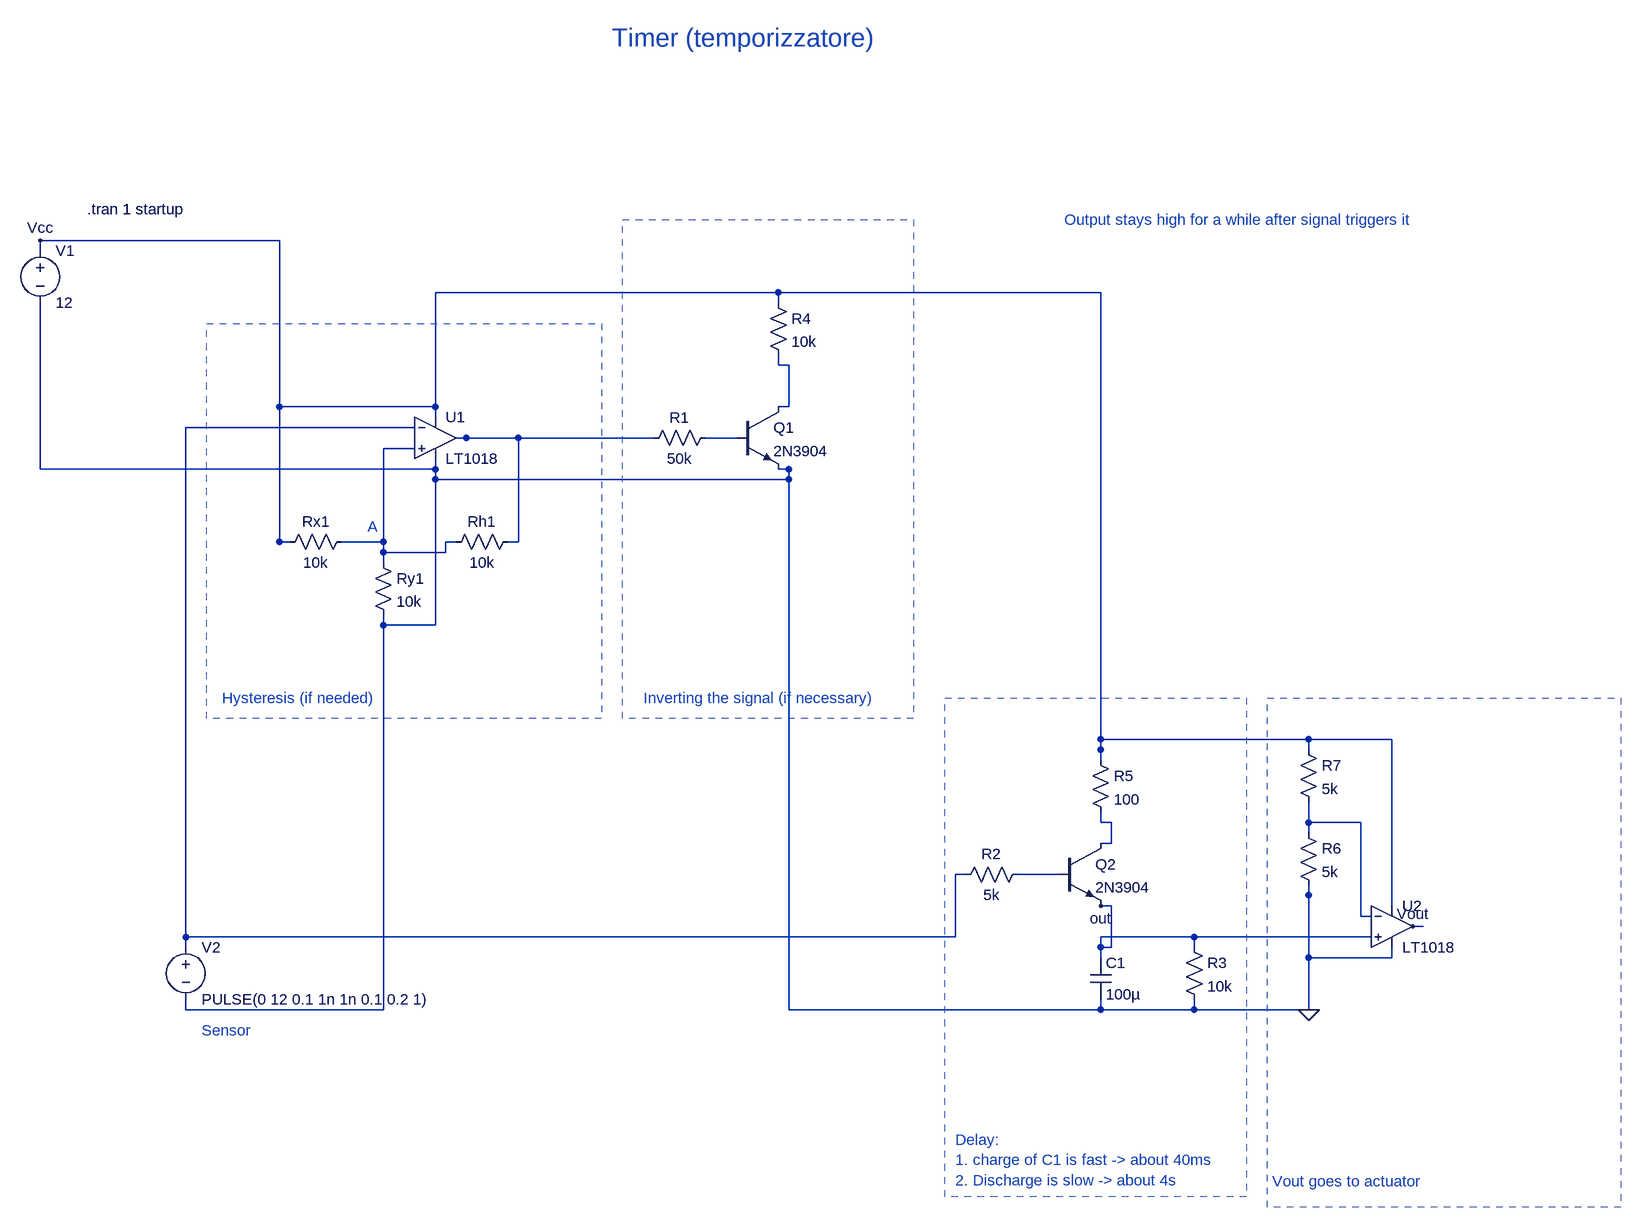
[diagram p0: schematic Sensor-triggered-timer-temporizzatore-2.asc]
Sensor-triggered-timer-temporizzatore-2.asc, the LTspice schematic file:
Version 4.1
SHEET 1 1716 680
WIRE 912 272 912 288
WIRE 416 -544 432 -544
WIRE 1056 272 1056 288
WIRE 1232 96 1232 112
WIRE -192 -320 -192 -304
WIRE -112 -560 -112 -544
WIRE 1360 192 1360 208
WIRE -720 -800 -720 -784
WIRE -496 272 -496 288
WIRE 912 288 1056 288
WIRE 1056 288 1232 288
WIRE 1232 288 1232 112
WIRE 1232 112 1232 208
WIRE 1232 208 1360 208
WIRE 912 288 432 288
WIRE 432 288 432 -544
WIRE 432 -544 432 -528
WIRE 432 -528 -112 -528
WIRE -112 -528 -112 -544
WIRE -112 -544 -112 -304
WIRE -112 -304 -192 -304
WIRE -112 -544 -720 -544
WIRE -720 -544 -720 -784
WIRE -192 -304 -192 288
WIRE -192 288 -496 288
FLAG 1232 288 0
WIRE 416 -640 432 -640
WIRE 416 -720 416 -704
WIRE 432 -640 432 -704
WIRE 432 -704 416 -704
WIRE 704 80 688 80
WIRE -144 -608 -160 -608
WIRE -496 192 -496 176
WIRE 688 80 688 176
WIRE 688 176 -496 176
WIRE -496 176 -496 -608
WIRE -496 -608 -160 -608
WIRE 224 -592 208 -592
WIRE 0 -432 16 -432
WIRE -80 -592 -64 -592
WIRE 208 -592 -64 -592
WIRE -64 -592 16 -592
WIRE 16 -592 16 -432
WIRE 352 -592 336 -592
WIRE 304 -592 320 -592
WIRE 336 -592 320 -592
WIRE -80 -432 -96 -432
WIRE -256 -432 -240 -432
WIRE -192 -400 -192 -416
WIRE -144 -576 -160 -576
WIRE -96 -432 -96 -416
WIRE -96 -416 -192 -416
WIRE -192 -416 -192 -432
WIRE -192 -432 -240 -432
WIRE -192 -416 -192 -576
WIRE -192 -576 -160 -576
WIRE 1232 16 1232 0
WIRE 1232 -32 1232 -16
WIRE 1328 144 1312 144
WIRE 1232 0 1232 -16
WIRE 1232 0 1312 0
WIRE 1312 0 1312 144
WIRE 912 32 928 32
WIRE 912 -16 912 0
WIRE 928 32 928 0
WIRE 928 0 912 0
WIRE 848 80 832 80
WIRE 784 80 800 80
WIRE 832 80 800 80
WIRE 416 -800 416 -816
WIRE 912 -96 912 -112
WIRE 1232 -112 1232 -128
WIRE -336 -432 -352 -432
WIRE -112 -624 -112 -640
WIRE 1360 128 1360 112
WIRE -720 -880 -720 -896
WIRE 416 -816 -112 -816
WIRE -112 -816 -112 -640
WIRE -112 -640 -352 -640
WIRE -352 -640 -352 -432
WIRE -352 -432 -352 -896
WIRE -352 -896 -720 -896
WIRE 416 -816 912 -816
WIRE 912 -816 912 -112
WIRE 912 -112 912 -128
WIRE 912 -128 1232 -128
WIRE 1232 -128 1360 -128
WIRE 1360 -128 1360 112
FLAG -720 -896 Vcc
WIRE 1392 160 1408 160
FLAG 1392 160 Vout
WIRE 912 208 912 192
WIRE 912 128 928 128
WIRE 1056 192 1056 176
WIRE 1328 176 1312 176
WIRE 912 192 928 192
WIRE 928 192 928 128
WIRE 912 192 912 176
WIRE 912 176 1056 176
WIRE 1056 176 1312 176
FLAG 912 128 out
SYMBOL Comparators\\LT1018 -112 -592 R0
SYMATTR InstName U1
SYMBOL voltage -720 -896 R0
WINDOW 123 0 0 Left 0
WINDOW 39 0 0 Left 0
SYMATTR InstName V1
SYMATTR Value 12
SYMBOL res -240 -448 R90
WINDOW 0 0 56 VBottom 2
WINDOW 3 32 56 VTop 2
SYMATTR InstName Rx1
SYMATTR Value 10k
SYMBOL res -208 -416 R0
SYMATTR InstName Ry1
SYMATTR Value 10k
SYMBOL res 16 -448 R90
WINDOW 0 0 56 VBottom 2
WINDOW 3 32 56 VTop 2
SYMATTR InstName Rh1
SYMATTR Value 10k
SYMBOL res 320 -608 R90
WINDOW 0 0 56 VBottom 2
WINDOW 3 32 56 VTop 2
SYMATTR InstName R1
SYMATTR Value 50k
SYMBOL cap 896 208 R0
SYMATTR InstName C1
SYMATTR Value 100µ
SYMBOL res 1040 176 R0
SYMATTR InstName R3
SYMATTR Value 10k
SYMBOL voltage -496 176 R0
WINDOW 123 0 0 Left 0
WINDOW 39 0 0 Left 0
SYMATTR InstName V2
SYMATTR Value PULSE(0 12 0.1 1n 1n 0.1 0.2 1)
SYMBOL npn 352 -640 R0
SYMATTR InstName Q1
SYMATTR Value 2N3904
SYMBOL res 400 -816 R0
SYMATTR InstName R4
SYMATTR Value 10k
SYMBOL res 800 64 R90
WINDOW 0 0 56 VBottom 2
WINDOW 3 32 56 VTop 2
SYMATTR InstName R2
SYMATTR Value 5k
SYMBOL npn 848 32 R0
SYMATTR InstName Q2
SYMATTR Value 2N3904
SYMBOL res 896 -112 R0
SYMATTR InstName R5
SYMATTR Value 100
SYMBOL Comparators\\LT1018 1360 160 R0
SYMATTR InstName U2
SYMBOL res 1216 0 R0
SYMATTR InstName R6
SYMATTR Value 5k
SYMBOL res 1216 -128 R0
SYMATTR InstName R7
SYMATTR Value 5k
TEXT -648 -944 Left 2 !.tran 1 startup
TEXT -216 -456 Left 2 ;A
TEXT -440 -192 Left 2 ;Hysteresis (if needed)
TEXT 208 -192 Left 2 ;Inverting the signal (if necessary)
TEXT 688 488 Left 2 ;Delay:\n1. charge of C1 is fast -> about 40ms\n2. Discharge is slow -> about 4s
TEXT 1176 552 Left 2 ;Vout goes to actuator
TEXT -472 320 Left 2 ;Sensor
TEXT 160 -1208 Left 4 ;Timer (temporizzatore)
TEXT 856 -928 Left 2 ;Output stays high for a while after signal triggers it
RECTANGLE Normal 144 -160 -464 -768 2
RECTANGLE Normal 1136 576 672 -192 2
RECTANGLE Normal 1712 592 1168 -192 2
RECTANGLE Normal 624 -160 176 -928 2

The netlist it stands for:
* Sensor-triggered-timer-temporizzatore-2.asc
X§U1 N005 N002 Vcc 0 N003 LT1018  ; pins In+ In- V+ V- OUT
V1 Vcc 0 12
Rx1 N005 Vcc 10k
Ry1 N005 0 10k
Rh1 N003 N005 10k
R1 N004 N003 50k
C1 out 0 100µ
R3 out 0 10k
V2 N002 0 PULSE(0 12 0.1 1n 1n 0.1 0.2 1)
Q1 N001 N004 0 0 2N3904
R4 Vcc N001 10k
R2 N008 N002 5k
Q2 N007 N008 out 0 2N3904
R5 Vcc N007 100
X§U2 out N006 Vcc 0 Vout LT1018  ; pins In+ In- V+ V- OUT
R6 N006 0 5k
R7 Vcc N006 5k
.model NPN NPN
.model PNP PNP
.lib standard.bjt
.tran 1 startup
* A
* Hysteresis (if needed)
* Inverting the signal (if necessary)
* Delay:
* 1. charge of C1 is fast -> about 40ms
* 2. Discharge is slow -> about 4s
* Vout goes to actuator
* Sensor
* Timer (temporizzatore)
* Output stays high for a while after signal triggers it
.lib LTC1.lib
.backanno
.end